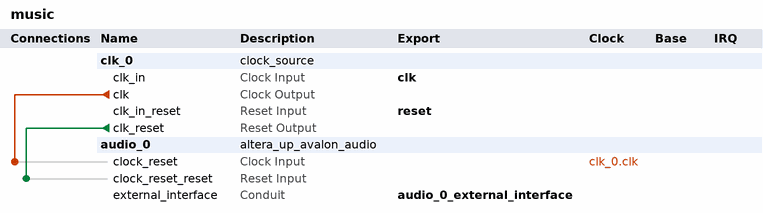
[diagram p0: system contents]
# Platform Designer (Qsys) system music, Cyclone IV E EP4CE115F29C7
# Parameters at their usual value, and those the tool derives, are not listed.
package require -exact qsys 13.1
create_system music
set_project_property DEVICE_FAMILY {Cyclone IV E}
set_project_property DEVICE EP4CE115F29C7

add_instance clk_0 clock_source 13.1
set_instance_parameter_value clk_0 clockFrequency 50000000

add_instance audio_0 altera_up_avalon_audio 13.1
set_instance_parameter_value audio_0 avalon_bus_type {Memory Mapped}
set_instance_parameter_value audio_0 audio_in true
set_instance_parameter_value audio_0 dw 16

# connections
add_connection clk_0.clk audio_0.clock_reset clock
add_connection clk_0.clk_reset audio_0.clock_reset_reset reset

# exported interfaces
add_interface clk clock sink
set_interface_property clk EXPORT_OF clk_0.clk_in
add_interface audio_0_external_interface conduit end
set_interface_property audio_0_external_interface EXPORT_OF audio_0.external_interface
add_interface reset reset sink
set_interface_property reset EXPORT_OF clk_0.clk_in_reset

set_interconnect_requirement {$system} qsys_mm.clockCrossingAdapter HANDSHAKE
set_interconnect_requirement {$system} qsys_mm.maxAdditionalLatency 1
set_interconnect_requirement {$system} qsys_mm.insertDefaultSlave false

save_system music.qsys
